# Altium schematic sheet LED_bank.SchDoc
size B portrait
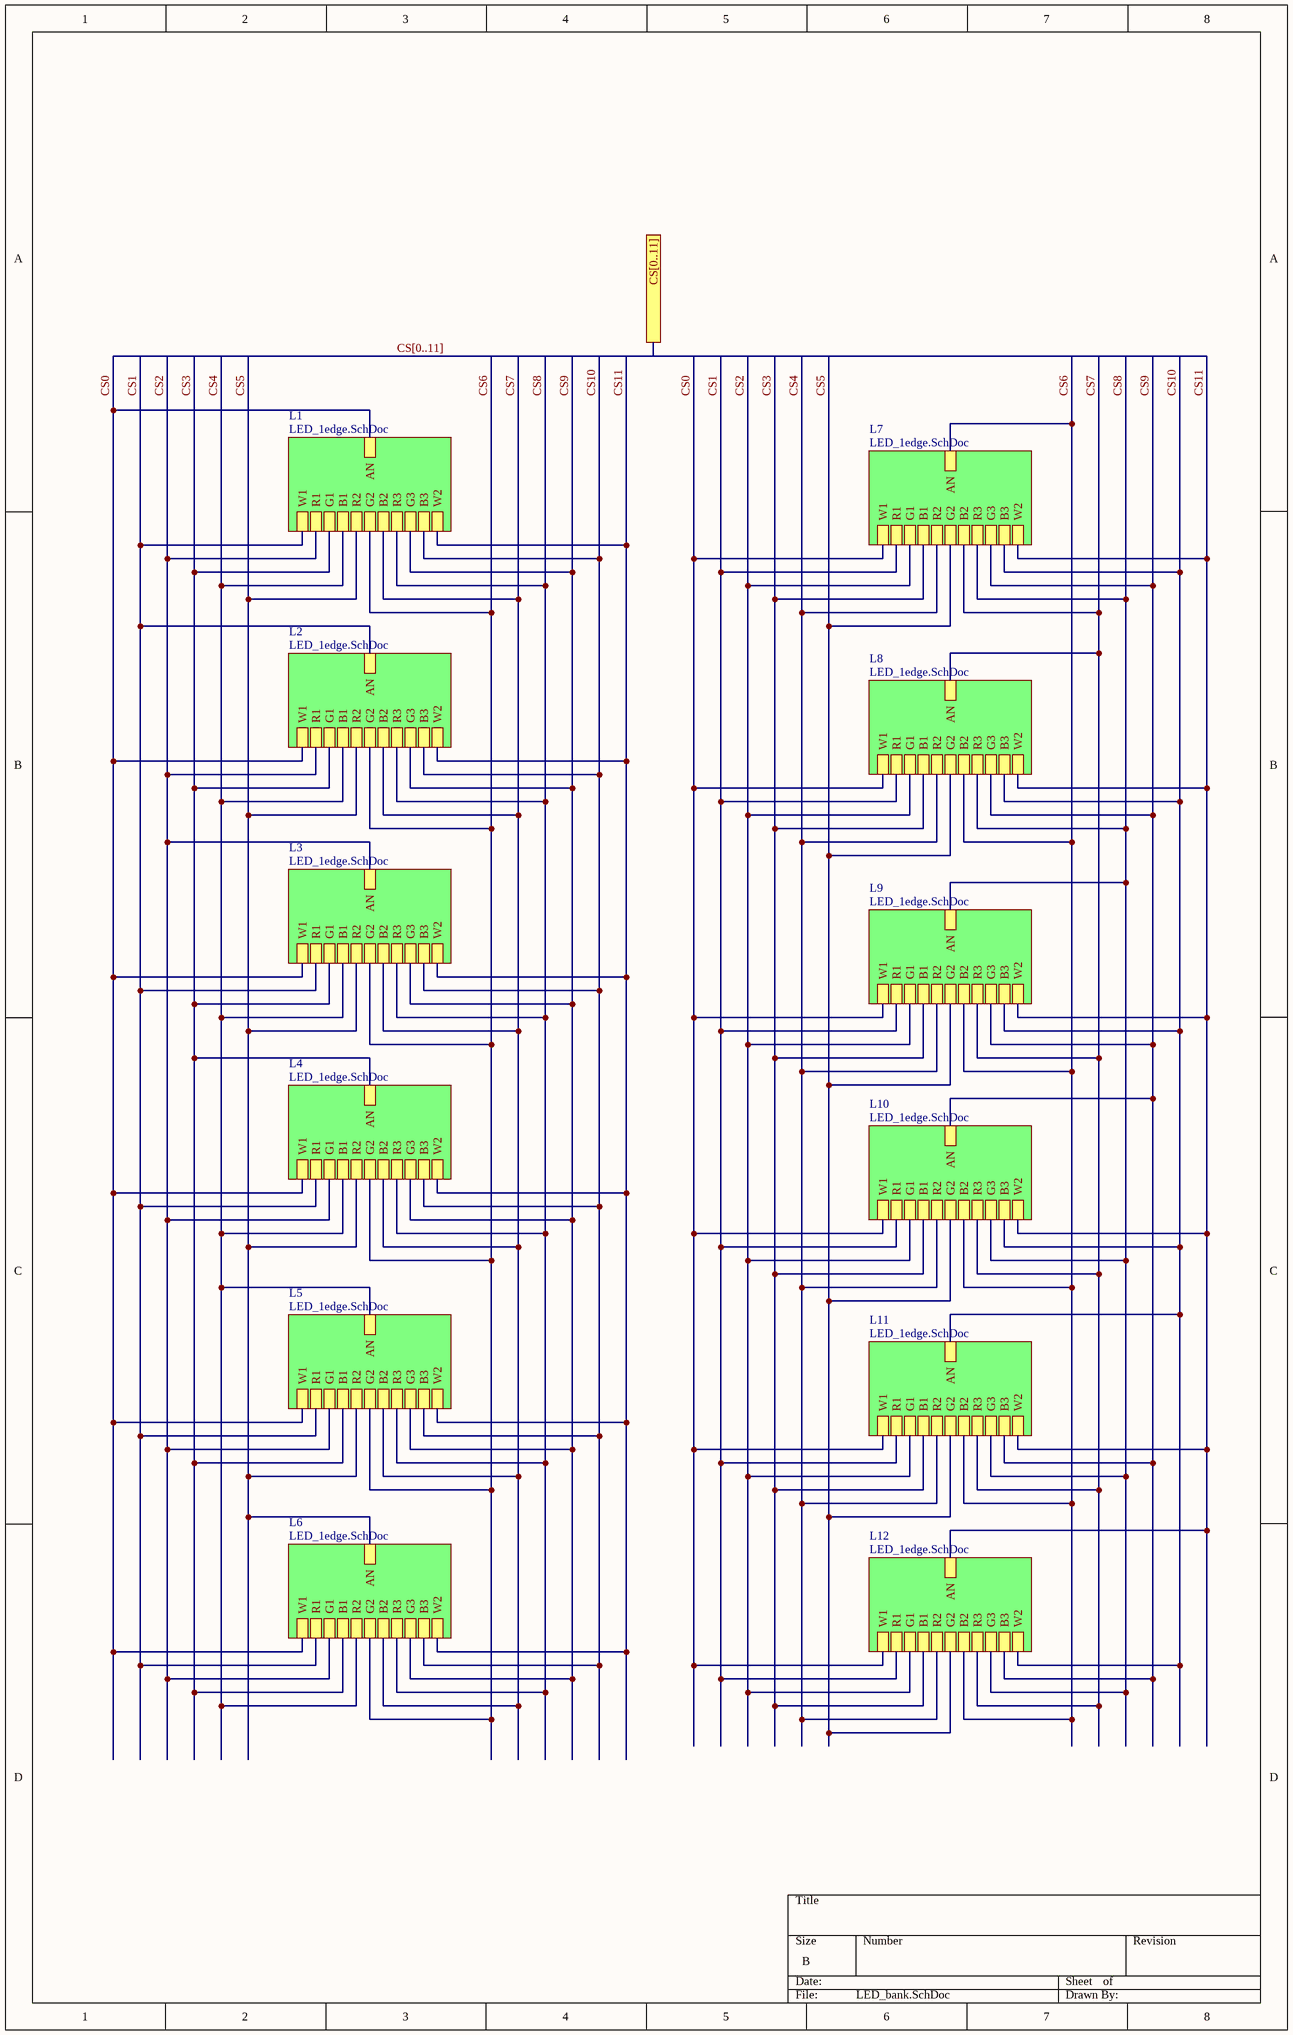
[diagram p0: LED_bank.SchDoc]

## Sub-sheets
L1 = LED_1edge.SchDoc: AN, R1, G1, B1, R2, G2, B2, R3, G3, B3, W1, W2
L2 = LED_1edge.SchDoc: AN, R1, G1, B1, R2, G2, B2, R3, G3, B3, W1, W2
L3 = LED_1edge.SchDoc: AN, R1, G1, B1, R2, G2, B2, R3, G3, B3, W1, W2
L4 = LED_1edge.SchDoc: AN, R1, G1, B1, R2, G2, B2, R3, G3, B3, W1, W2
L5 = LED_1edge.SchDoc: AN, R1, G1, B1, R2, G2, B2, R3, G3, B3, W1, W2
L6 = LED_1edge.SchDoc: AN, R1, G1, B1, R2, G2, B2, R3, G3, B3, W1, W2
L7 = LED_1edge.SchDoc: AN, R1, G1, B1, R2, G2, B2, R3, G3, B3, W1, W2
L8 = LED_1edge.SchDoc: AN, R1, G1, B1, R2, G2, B2, R3, G3, B3, W1, W2
L9 = LED_1edge.SchDoc: AN, R1, G1, B1, R2, G2, B2, R3, G3, B3, W1, W2
L10 = LED_1edge.SchDoc: AN, R1, G1, B1, R2, G2, B2, R3, G3, B3, W1, W2
L11 = LED_1edge.SchDoc: AN, R1, G1, B1, R2, G2, B2, R3, G3, B3, W1, W2
L12 = LED_1edge.SchDoc: AN, R1, G1, B1, R2, G2, B2, R3, G3, B3, W1, W2

## Ports
CS[0..11]

## Nets
CS0: sheet L1/AN, sheet L2/W1, sheet L3/W1, sheet L4/W1, sheet L5/W1, sheet L6/W1, sheet L7/W1, sheet L8/W1, sheet L9/W1, sheet L10/W1, sheet L11/W1, sheet L12/W1
CS1: sheet L1/W1, sheet L2/AN, sheet L3/R1, sheet L4/R1, sheet L5/R1, sheet L6/R1, sheet L7/R1, sheet L8/R1, sheet L9/R1, sheet L10/R1, sheet L11/R1, sheet L12/R1
CS2: sheet L1/R1, sheet L2/R1, sheet L3/AN, sheet L4/G1, sheet L5/G1, sheet L6/G1, sheet L7/G1, sheet L8/G1, sheet L9/G1, sheet L10/G1, sheet L11/G1, sheet L12/G1
CS3: sheet L1/G1, sheet L2/G1, sheet L3/G1, sheet L4/AN, sheet L5/B1, sheet L6/B1, sheet L7/B1, sheet L8/B1, sheet L9/B1, sheet L10/B1, sheet L11/B1, sheet L12/B1
CS4: sheet L1/B1, sheet L2/B1, sheet L3/B1, sheet L4/B1, sheet L5/AN, sheet L6/R2, sheet L7/R2, sheet L8/R2, sheet L9/R2, sheet L10/R2, sheet L11/R2, sheet L12/R2
CS5: sheet L1/R2, sheet L2/R2, sheet L3/R2, sheet L4/R2, sheet L5/R2, sheet L6/AN, sheet L7/G2, sheet L8/G2, sheet L9/G2, sheet L10/G2, sheet L11/G2, sheet L12/G2
CS6: sheet L1/G2, sheet L2/G2, sheet L3/G2, sheet L4/G2, sheet L5/G2, sheet L6/G2, sheet L7/AN, sheet L8/B2, sheet L9/B2, sheet L10/B2, sheet L11/B2, sheet L12/B2
CS7: sheet L1/B2, sheet L2/B2, sheet L3/B2, sheet L4/B2, sheet L5/B2, sheet L6/B2, sheet L7/B2, sheet L8/AN, sheet L9/R3, sheet L10/R3, sheet L11/R3, sheet L12/R3
CS8: sheet L1/R3, sheet L2/R3, sheet L3/R3, sheet L4/R3, sheet L5/R3, sheet L6/R3, sheet L7/R3, sheet L8/R3, sheet L9/AN, sheet L10/G3, sheet L11/G3, sheet L12/G3
CS9: sheet L1/G3, sheet L2/G3, sheet L3/G3, sheet L4/G3, sheet L5/G3, sheet L6/G3, sheet L7/G3, sheet L8/G3, sheet L9/G3, sheet L10/AN, sheet L11/B3, sheet L12/B3
CS10: sheet L1/B3, sheet L2/B3, sheet L3/B3, sheet L4/B3, sheet L5/B3, sheet L6/B3, sheet L7/B3, sheet L8/B3, sheet L9/B3, sheet L10/B3, sheet L11/AN, sheet L12/W2
CS11: sheet L1/W2, sheet L2/W2, sheet L3/W2, sheet L4/W2, sheet L5/W2, sheet L6/W2, sheet L7/W2, sheet L8/W2, sheet L9/W2, sheet L10/W2, sheet L11/W2, sheet L12/AN

## Buses and harness runs
bus CS[0..11] = port CS[0..11]